# EAGLE schematic gun_heater (EAGLE 9.2.2)
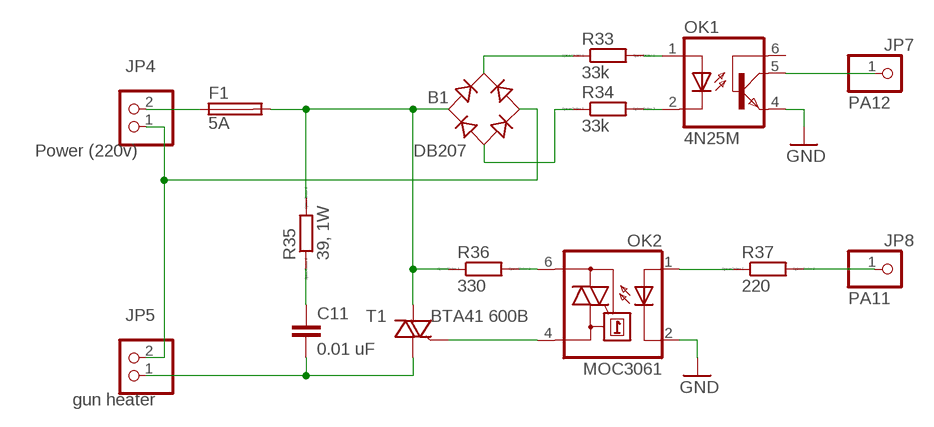
[diagram p0: schematic, sheet 1]

## Parts
B1  DB207  B-DIL  [B-DIL]
C11  0.01 uF  C-EU050-024X044  [C050-024X044]
F1  5A  TE5  [TE5]
JP4  Power (220v)  PINHD-1X2  [1X02]
JP5  gun heater  PINHD-1X2  [1X02]
JP7  PA12  PINHD-1X1  [1X01]
JP8  PA11  PINHD-1X1  [1X01]
OK1  4N25M  [DIL06]
OK2  MOC3061  MOC3021M  [DIL06]
R33  33k  R0204/7  [0204/7]
R34  33k  R0204/7  [0204/7]
R35  39, 1W  R0204/7  [0204/7]
R36  330  R0204/7  [0204/7]
R37  220  R0204/7  [0204/7]
T1  BTA41 600B  BTA26-H  [TOP3L-1]

## Nets
GND: OK1.4(EMI) OK2.2(C)
N$1: B1.AC2 JP4.1 JP5.2
N$2: C11.2 JP5.1 T1.A1
N$3: C11.1 R35.1
N$4: B1.AC1 F1.2 R35.2 R36.1 T1.A2
N$5: OK2.4(A1) T1.G
N$6: OK2.6(A2) R36.2
N$7: OK2.1(A) R37.1
N$8: JP8.1 R37.2
N$9: B1.+ R33.1
N$10: OK1.1(A) R33.2
N$11: B1.- R34.1
N$12: OK1.2(C) R34.2
N$13: JP7.1 OK1.5(COL)
N$14: F1.1 JP4.2
Unconnected: OK1.6(BAS)

## Library data of the parts
B1 = rectifier:B-DIL: RECTIFIER
C11 = rcl:C-EU: CAPACITOR, European symbol; SPICEPREFIX: C
F1 = fuse:TE5: FUSE Wickmann; OC_FARNELL: unknown; OC_NEWARK: unknown
JP4 JP5 = pinhead:PINHD-1X2: PIN HEADER
JP7 JP8 = pinhead:PINHD-1X1: PIN HEADER
OK1 = optocoupler:4N*?M: General Purpose 6-Pin Phototransistor Optocouplers Source: http://www.fairchildsemi.com/ds/4N/4N35-M.pdf; MPN: 4N25-M; OC_FARNELL: 1021349; OC_NEWARK: 98K9084
OK2 = optocoupler:MOC30*M: RANDOM-PHASE OPTOISOLATORS TRIAC DRIVER OUTPUT Source: http://www.fairchildsemi.com MOC3020-M.pdf; MF: FAIRCHILD SEMICONDUCTOR; MPN: MOC3021-M; OC_FARNELL: 1021365; OC_NEWARK: 95B7895
R33-R37 = eagle-ltspice:R: RESISTOR, European symbol; SPICEMODEL: NONE; SPICEPREFIX: R
T1 = triac:BTA26: 25A TRIAC Source: http://www.st.com/stonline/products/literature/ds/7470.pdf